# EAGLE schematic SQR_FG (EAGLE 7.2.0)
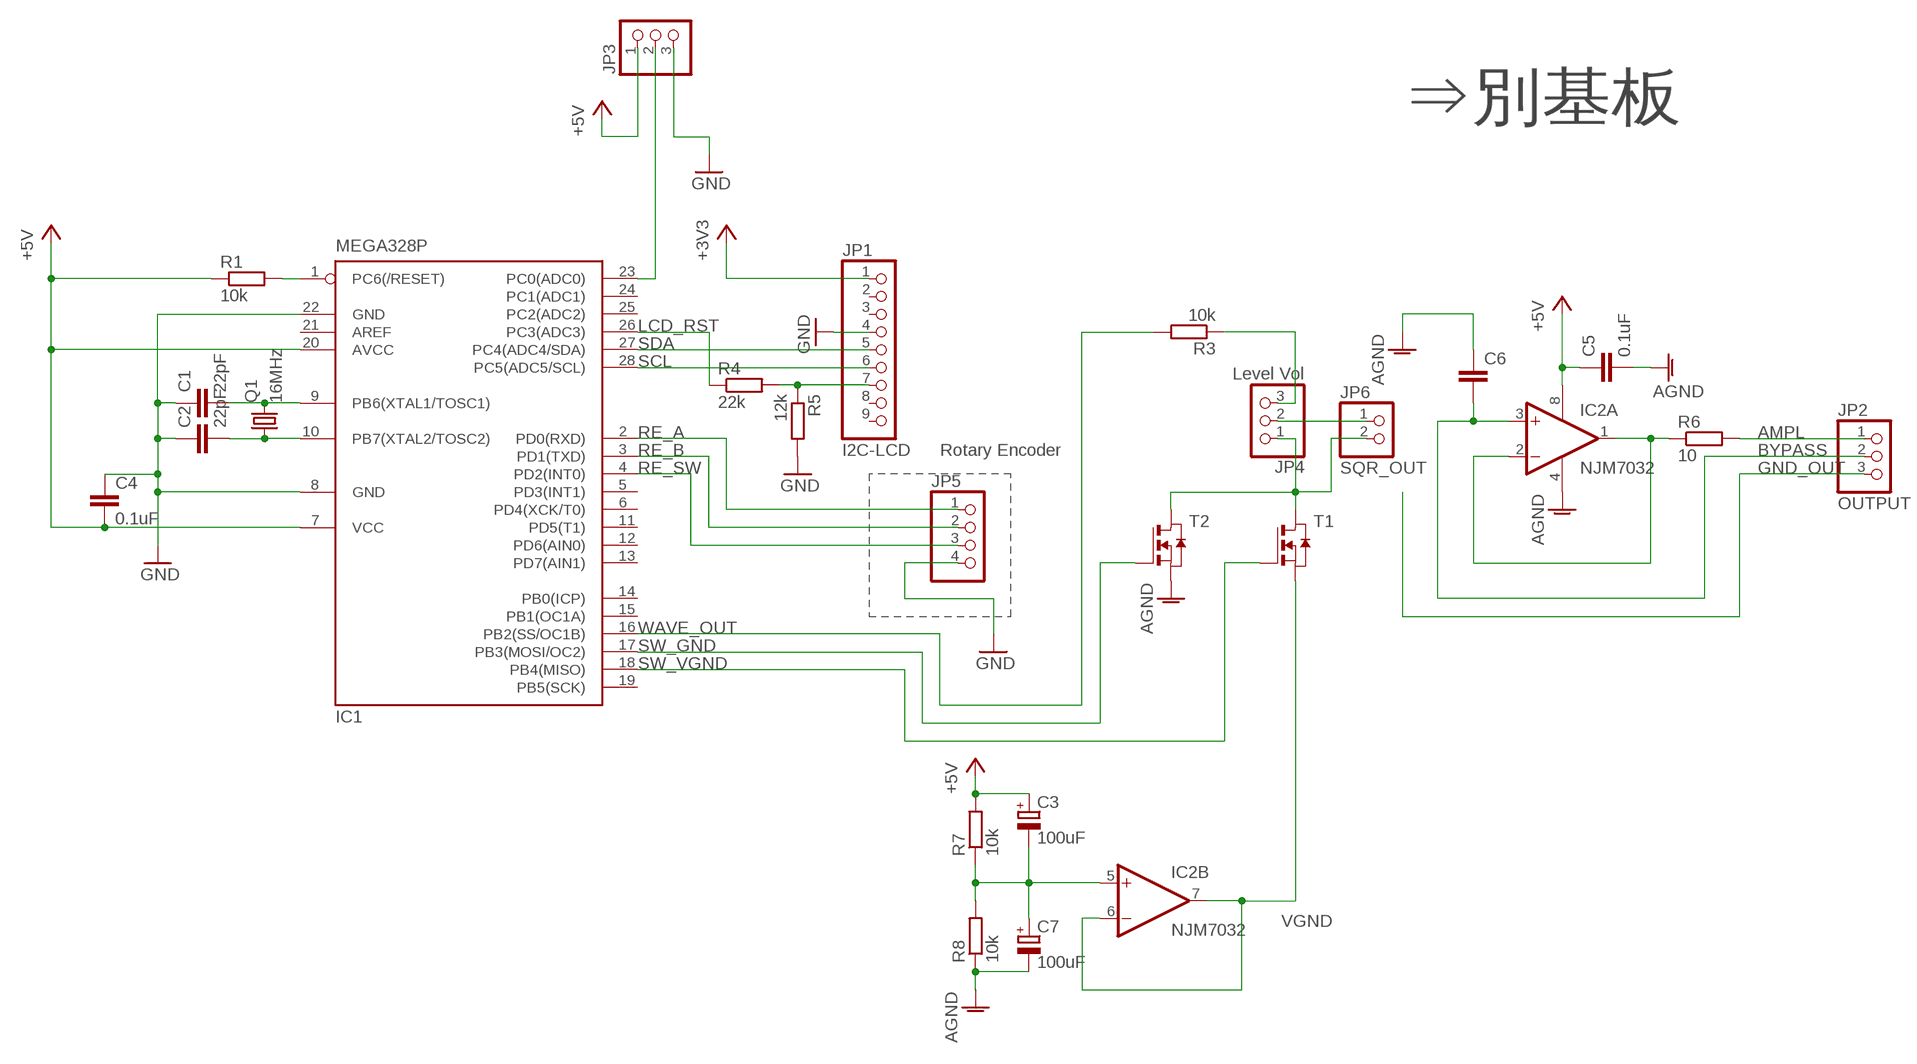
[diagram p0: schematic, sheet 1]

## Parts
C1  22pF  C-EU025-024X044  [C025-024X044]
C2  22pF  C-EU025-024X044  [C025-024X044]
C3  100uF  CPOL-EUE2.5-5  [E2,5-5]
C4  0.1uF  C-EU025-024X044  [C025-024X044]
C5  0.1uF  C-EU025-024X044  [C025-024X044]
C6  C-EU025-024X044  [C025-024X044]
C7  100uF  CPOL-EUE2.5-5  [E2,5-5]
IC1  MEGA328P  MEGA8-P  [DIL28-3]
IC2  NJM7032  LM358N  [DIL08]
JP1  I2C-LCD  PINHD-1X9  [1X09]
JP2  OUTPUT  PINHD-1X3  [1X03]
JP3  PINHD-1X3  [1X03]
JP4  Level Vol  PINHD-1X3  [1X03]
JP5  PINHD-1X4  [1X04]
JP6  SQR_OUT  PINHD-1X2  [1X02]
Q1  16MHz  CRYSTALHC49S  [HC49/S]
R1  10k  R-EU_0207/7  [0207/7]
R3  10k  R-EU_0207/7  [0207/7]
R4  22k  R-EU_0207/7  [0207/7]
R5  12k  R-EU_0207/7  [0207/7]
R6  10  R-EU_0207/7  [0207/7]
R7  10k  R-EU_0207/7  [0207/7]
R8  10k  R-EU_0207/7  [0207/7]
T1  NMOSE3L  [E3LINE]
T2  NMOSE3L  [E3LINE]

## Nets
+3V3: JP1.1
+5V: C3.+ C4.2 C5.1 IC1.7(VCC) IC1.20(AVCC) IC2.8(P:V+) JP3.1 R1.1 R7.2
AGND: C5.2 C6.1 C7.- IC2.4(P:V-) R8.1 T2.3(S)
AMPL: JP2.1 R6.2
BYPASS: C6.2 IC2.3(A:+IN) JP2.2
GND: C1.1 C2.1 C4.1 IC1.8(GND) IC1.22(GND) JP1.4 JP3.3 JP5.4 R5.2
GND_OUT: JP2.3
LCD_RST: IC1.26(PC3(ADC3)) R4.1
N$1: C1.2 IC1.9(PB6(XTAL1/TOSC1)) Q1.2
N$2: C2.2 IC1.10(PB7(XTAL2/TOSC2)) Q1.1
N$3: IC1.1(PC6(/RESET)) R1.2
N$4: JP4.2 JP6.1
N$5: JP4.1 JP6.2 T1.1(D) T2.1(D)
N$8: JP4.3 R3.1
N$9: IC1.23(PC0(ADC0)) JP3.2
N$16: IC2.1(A:OUT) IC2.2(A:-IN) R6.1
N$17: C3.- C7.+ IC2.5(B:+IN) R7.1 R8.2
RE_A: IC1.2(PD0(RXD)) JP5.1
RE_B: IC1.3(PD1(TXD)) JP5.2
RE_SW: IC1.4(PD2(INT0)) JP5.3
RST: JP1.7 R4.2 R5.1
SCL: IC1.28(PC5(ADC5/SCL)) JP1.6
SDA: IC1.27(PC4(ADC4/SDA)) JP1.5
SW_GND: IC1.17(PB3(MOSI/OC2)) T2.2(G)
SW_VGND: IC1.18(PB4(MISO)) T1.2(G)
VGND: IC2.6(B:-IN) IC2.7(B:OUT) T1.3(S)
WAVE_OUT: IC1.16(PB2(SS/OC1B)) R3.2
Unconnected: IC1.5(PD3(INT1)) IC1.6(PD4(XCK/T0)) IC1.11(PD5(T1)) IC1.12(PD6(AIN0)) IC1.13(PD7(AIN1)) IC1.14(PB0(ICP)) IC1.15(PB1(OC1A)) IC1.19(PB5(SCK)) IC1.21(AREF) IC1.24(PC1(ADC1)) IC1.25(PC2(ADC2)) JP1.2 JP1.3 JP1.8 JP1.9

## Notes on the sheet
- ⇒別基板
- Rotary Encoder

## Library data of the parts
C1 C2 C4-C6 = rcl:C-EU: CAPACITOR, European symbol
C3 C7 = rcl:CPOL-EU: POLARIZED CAPACITOR, European symbol
IC1 = atmel:MEGA8-P: MICROCONTROLLER 8 Kbytes FLASH, 1 kbytes SRAM, 512 bytes EEPROM, USART, 4-channel 10 bit ADC, 2-channel 8 bit ADC Pin compatible with Atmega48, ATMega88, ATMega168 Source: avr.lbr; OC_FARNELL: unknown; OC_NEWARK: unknown
IC2 = linear:LM358: OP AMP also LM158; LM258; LM2904 Source: http://cache.national.com/ds/LM/LM158.pdf
JP1 = pinhead:PINHD-1X9: PIN HEADER
JP2-JP4 = pinhead:PINHD-1X3: PIN HEADER
JP5 = pinhead:PINHD-1X4: PIN HEADER
JP6 = pinhead:PINHD-1X2: PIN HEADER
Q1 = crystal:CRYSTAL: CRYSTAL; OC_FARNELL: 1667008; OC_NEWARK: unknown
R1 R3-R8 = rcl:R-EU_: RESISTOR, European symbol
T1 T2 = zetex:NMOSE3L: MOS FET; OC_FARNELL: unknown; OC_NEWARK: unknown